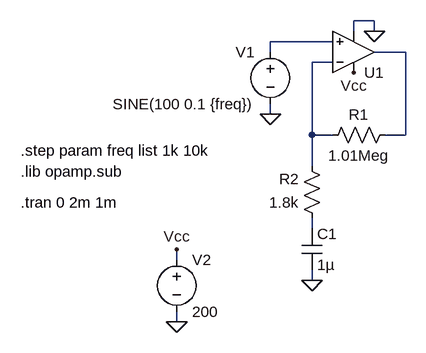
[diagram p0: schematic slew rate.asc]
slew rate.asc, the LTspice schematic file:
Version 4
SHEET 1 880 680
WIRE 272 64 240 64
WIRE 240 80 240 64
WIRE 272 80 272 64
WIRE 208 96 112 96
WIRE 112 112 112 96
WIRE 320 112 272 112
WIRE 208 128 176 128
WIRE 112 208 112 192
WIRE 176 240 176 128
WIRE 208 240 176 240
WIRE 320 240 320 112
WIRE 320 240 288 240
WIRE 176 288 176 240
WIRE 176 384 176 368
WIRE -32 432 -32 416
WIRE 176 464 176 448
WIRE -32 528 -32 512
FLAG 176 464 0
FLAG 112 208 0
FLAG 240 144 Vcc
FLAG 272 80 0
FLAG -32 528 0
FLAG -32 416 Vcc
SYMBOL voltage 112 96 M0
WINDOW 123 0 0 Left 2
WINDOW 39 0 0 Left 2
SYMATTR InstName V1
SYMATTR Value SINE(100 0.1 {freq})
SYMBOL res 304 224 R90
WINDOW 0 0 56 VBottom 2
WINDOW 3 32 56 VTop 2
SYMATTR InstName R1
SYMATTR Value 1.01Meg
SYMBOL res 192 384 R180
WINDOW 0 36 76 Left 2
WINDOW 3 36 40 Left 2
SYMATTR InstName R2
SYMATTR Value 1.8k
SYMBOL Opamps\\UniversalOpamp2 240 112 M180
SYMATTR InstName U1
SYMATTR Value2 Avol=1Meg GBW=10Meg Slew=1Meg
SYMBOL voltage -32 416 R0
WINDOW 123 0 0 Left 2
WINDOW 39 0 0 Left 2
SYMATTR InstName V2
SYMATTR Value 200
SYMBOL cap 160 384 R0
SYMATTR InstName C1
SYMATTR Value 1µ
TEXT -272 264 Left 2 !.step param freq list 1k 10k
TEXT -272 344 Left 2 !.tran 0 2m 1m
TEXT -272 296 Left 2 !.lib opamp.sub

The netlist it stands for:
* slew rate.asc
V1 N001 0 SINE(100 0.1 {freq})
R1 N002 N003 1.01Meg
R2 N004 N003 1.8k
XU1 N001 N003 Vcc 0 N002 level.2 Avol=1Meg GBW=10Meg Slew=1Meg ilimit=25m rail=0 Vos=0 phimargin=45 en=0 enk=0 in=0 ink=0 Rin=500Meg  ; pins IN+ IN- V+ V- OUT
V2 Vcc 0 200
C1 N004 0 1µ
.step param freq list 1k 10k
.tran 0 2m 1m
.lib opamp.sub
.lib UniversalOpamps2.sub
.backanno
.end